# EAGLE schematic FLC_Circuit (EAGLE 9.5.2)
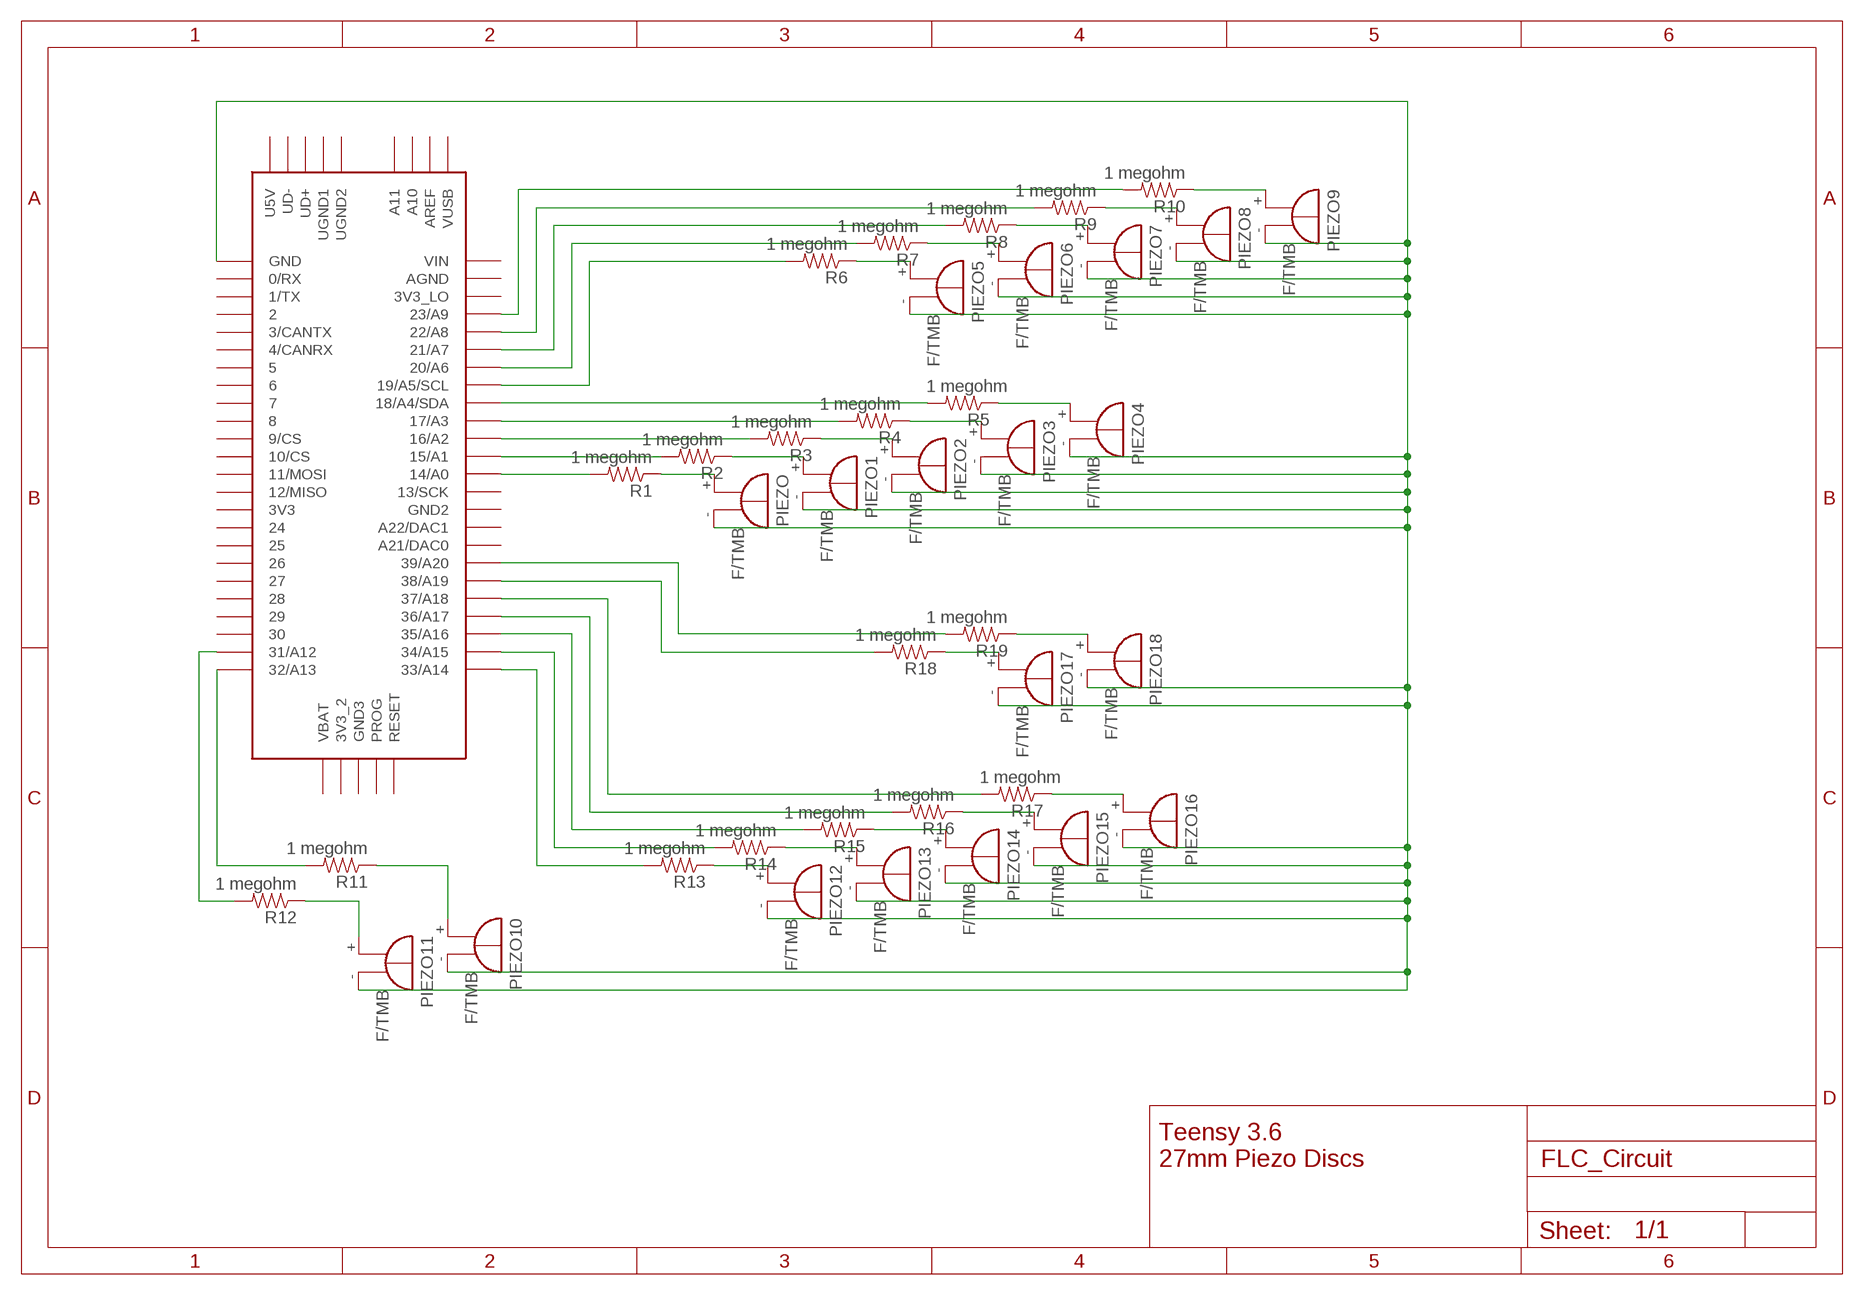
[diagram p0: schematic, sheet 1]

## Parts
PIEZO  F/TMB  [F/TMB]
PIEZO1  F/TMB  [F/TMB]
PIEZO2  F/TMB  [F/TMB]
PIEZO3  F/TMB  [F/TMB]
PIEZO4  F/TMB  [F/TMB]
PIEZO5  F/TMB  [F/TMB]
PIEZO6  F/TMB  [F/TMB]
PIEZO7  F/TMB  [F/TMB]
PIEZO8  F/TMB  [F/TMB]
PIEZO9  F/TMB  [F/TMB]
PIEZO10  F/TMB  [F/TMB]
PIEZO11  F/TMB  [F/TMB]
PIEZO12  F/TMB  [F/TMB]
PIEZO13  F/TMB  [F/TMB]
PIEZO14  F/TMB  [F/TMB]
PIEZO15  F/TMB  [F/TMB]
PIEZO16  F/TMB  [F/TMB]
PIEZO17  F/TMB  [F/TMB]
PIEZO18  F/TMB  [F/TMB]
R1  1 megohm  COMPONENT_RESISTOR-0805  [0805]
R2  1 megohm  COMPONENT_RESISTOR-0805  [0805]
R3  1 megohm  COMPONENT_RESISTOR-0805  [0805]
R4  1 megohm  COMPONENT_RESISTOR-0805  [0805]
R5  1 megohm  COMPONENT_RESISTOR-0805  [0805]
R6  1 megohm  COMPONENT_RESISTOR-0805  [0805]
R7  1 megohm  COMPONENT_RESISTOR-0805  [0805]
R8  1 megohm  COMPONENT_RESISTOR-0805  [0805]
R9  1 megohm  COMPONENT_RESISTOR-0805  [0805]
R10  1 megohm  COMPONENT_RESISTOR-0805  [0805]
R11  1 megohm  COMPONENT_RESISTOR-0805  [0805]
R12  1 megohm  COMPONENT_RESISTOR-0805  [0805]
R13  1 megohm  COMPONENT_RESISTOR-0805  [0805]
R14  1 megohm  COMPONENT_RESISTOR-0805  [0805]
R15  1 megohm  COMPONENT_RESISTOR-0805  [0805]
R16  1 megohm  COMPONENT_RESISTOR-0805  [0805]
R17  1 megohm  COMPONENT_RESISTOR-0805  [0805]
R18  1 megohm  COMPONENT_RESISTOR-0805  [0805]
R19  1 megohm  COMPONENT_RESISTOR-0805  [0805]
U$1  TEENSY_3.5/3.6  [TEENSY_3.5/3.6]

## Nets
N$1: R1.2 U$1.14/A0
N$2: PIEZO.+ R1.1
N$3: R2.2 U$1.15/A1
N$4: PIEZO1.+ R2.1
N$5: R3.2 U$1.16/A2
N$6: PIEZO2.+ R3.1
N$7: R4.2 U$1.17/A3
N$8: PIEZO3.+ R4.1
N$9: R5.2 U$1.18/A4/SDA
N$10: PIEZO4.+ R5.1
N$11: R6.2 U$1.19/A5/SCL
N$12: PIEZO5.+ R6.1
N$13: PIEZO6.+ R7.1
N$14: R7.2 U$1.20/A6
N$15: R8.2 U$1.21/A7
N$16: PIEZO7.+ R8.1
N$17: R9.2 U$1.22/A8
N$18: PIEZO8.+ R9.1
N$19: R10.2 U$1.23/A9
N$20: PIEZO9.+ R10.1
N$21: R18.2 U$1.38/A19
N$22: R11.2 U$1.32/A13
N$23: PIEZO11.+ R12.1
N$24: R12.2 U$1.31/A12
N$25: PIEZO10.+ R11.1
N$26: PIEZO12.+ R13.1
N$27: PIEZO13.+ R14.1
N$28: R14.2 U$1.34/A15
N$29: R15.2 U$1.35/A16
N$30: PIEZO14.+ R15.1
N$31: R16.2 U$1.36/A17
N$32: PIEZO15.+ R16.1
N$33: R17.2 U$1.37/A18
N$34: PIEZO16.+ R17.1
N$35: R13.2 U$1.33/A14
N$36: PIEZO17.+ R18.1
N$37: PIEZO18.+ R19.1
N$38: R19.2 U$1.39/A20
N$43: PIEZO1.- PIEZO2.- PIEZO3.- PIEZO4.- PIEZO5.- PIEZO6.- PIEZO7.- PIEZO8.- PIEZO9.- PIEZO10.- PIEZO11.- PIEZO12.- PIEZO13.- PIEZO14.- PIEZO15.- PIEZO16.- PIEZO17.- PIEZO18.- PIEZO.- U$1.GND
Unconnected: U$1.0/RX U$1.1/TX U$1.2 U$1.3/CANTX U$1.3V3 U$1.3V3_2 U$1.3V3_LO U$1.4/CANRX U$1.5 U$1.6 U$1.7 U$1.8 U$1.9/CS U$1.10/CS U$1.11/MOSI U$1.12/MISO U$1.13/SCK U$1.21/DAC0(A21/DAC0) U$1.24 U$1.25 U$1.26 U$1.27 U$1.28 U$1.29 U$1.30 U$1.A10 U$1.A11 U$1.A22/DAC1 U$1.AGND U$1.AREF U$1.GND2 U$1.GND3 U$1.PROG U$1.RESET U$1.U5V U$1.UD+ U$1.UD- U$1.UGND1 U$1.UGND2 U$1.VBAT U$1.VIN U$1.VUSB

## Notes on the sheet
- Teensy 3.6
  27mm Piezo Discs

## Library data of the parts
PIEZO PIEZO1-PIEZO18 = buzzer:F/TMB: BUZZER Source: Buerklin; OC_FARNELL: unknown; OC_NEWARK: unknown
R1-R19 = homemade-hardware:COMPONENT_RESISTOR
U$1 = Teensy356:TEENSY_3.5/3.6